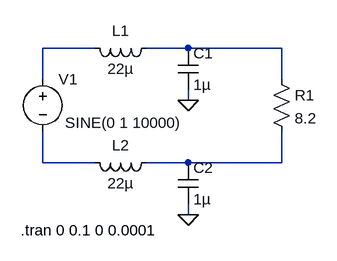
[diagram p0: schematic Draft.asc]
Draft.asc, the LTspice schematic file:
Version 4
SHEET 1 880 680
WIRE 16 128 -64 128
WIRE 160 128 96 128
WIRE 304 128 160 128
WIRE -64 176 -64 128
WIRE 304 176 304 128
WIRE 160 208 160 192
WIRE -64 304 -64 256
WIRE 16 304 -64 304
WIRE 160 304 96 304
WIRE 304 304 304 256
WIRE 304 304 160 304
WIRE 160 384 160 368
FLAG 160 208 0
FLAG 160 384 0
SYMBOL voltage -64 160 R0
WINDOW 3 34 83 Left 0
WINDOW 123 0 0 Left 0
WINDOW 39 0 0 Left 0
SYMATTR Value SINE(0 1 10000)
SYMATTR InstName V1
SYMBOL ind 112 112 R90
WINDOW 0 5 56 VBottom 0
WINDOW 3 32 56 VTop 0
SYMATTR InstName L1
SYMATTR Value 22µ
SYMATTR SpiceLine Ipk=1.2 Rser=0.217 Rpar=2073 Cpar=0 mfg="Coilcraft" pn="DO1813P-223HC"
SYMBOL ind 112 288 R90
WINDOW 0 5 56 VBottom 0
WINDOW 3 32 56 VTop 0
SYMATTR InstName L2
SYMATTR Value 22µ
SYMATTR SpiceLine Ipk=1.2 Rser=0.217 Rpar=2073 Cpar=0 mfg="Coilcraft" pn="DO1813P-223HC"
SYMBOL cap 144 128 R0
SYMATTR InstName C1
SYMATTR Value 1µ
SYMATTR SpiceLine V=16 Irms=0 Rser=0.007 MTBF=0 Lser=0 mfg="TDK" pn="C3216X7RIC105K" type="X7R" ppPkg=1
SYMBOL cap 144 304 R0
SYMATTR InstName C2
SYMATTR Value 1µ
SYMATTR SpiceLine V=16 Irms=0 Rser=0.007 MTBF=0 Lser=0 mfg="TDK" pn="C3216X7RIC105K" type="X7R" ppPkg=1
SYMBOL res 288 160 R0
SYMATTR InstName R1
SYMATTR Value 8.2
SYMATTR SpiceLine tol=5 pwr=2
TEXT -98 408 Left 0 !.tran 0 0.1 0 0.0001

The netlist it stands for:
* Draft.asc
V1 N001 N003 SINE(0 1 10000)
L1 N002 N001 22µ Ipk=1.2 Rser=0.217 Rpar=2073 Cpar=0 mfg="Coilcraft" pn="DO1813P-223HC"
L2 N004 N003 22µ Ipk=1.2 Rser=0.217 Rpar=2073 Cpar=0 mfg="Coilcraft" pn="DO1813P-223HC"
C1 N002 0 1µ V=16 Irms=0 Rser=0.007 MTBF=0 Lser=0 mfg="TDK" pn="C3216X7RIC105K" type="X7R" ppPkg=1
C2 N004 0 1µ V=16 Irms=0 Rser=0.007 MTBF=0 Lser=0 mfg="TDK" pn="C3216X7RIC105K" type="X7R" ppPkg=1
R1 N002 N004 8.2 tol=5 pwr=2
.tran 0 0.1 0 0.0001
.backanno
.end